# EAGLE schematic FCC Power Board Schematic (EAGLE 9.5.2)

## Sheet 1 of 2
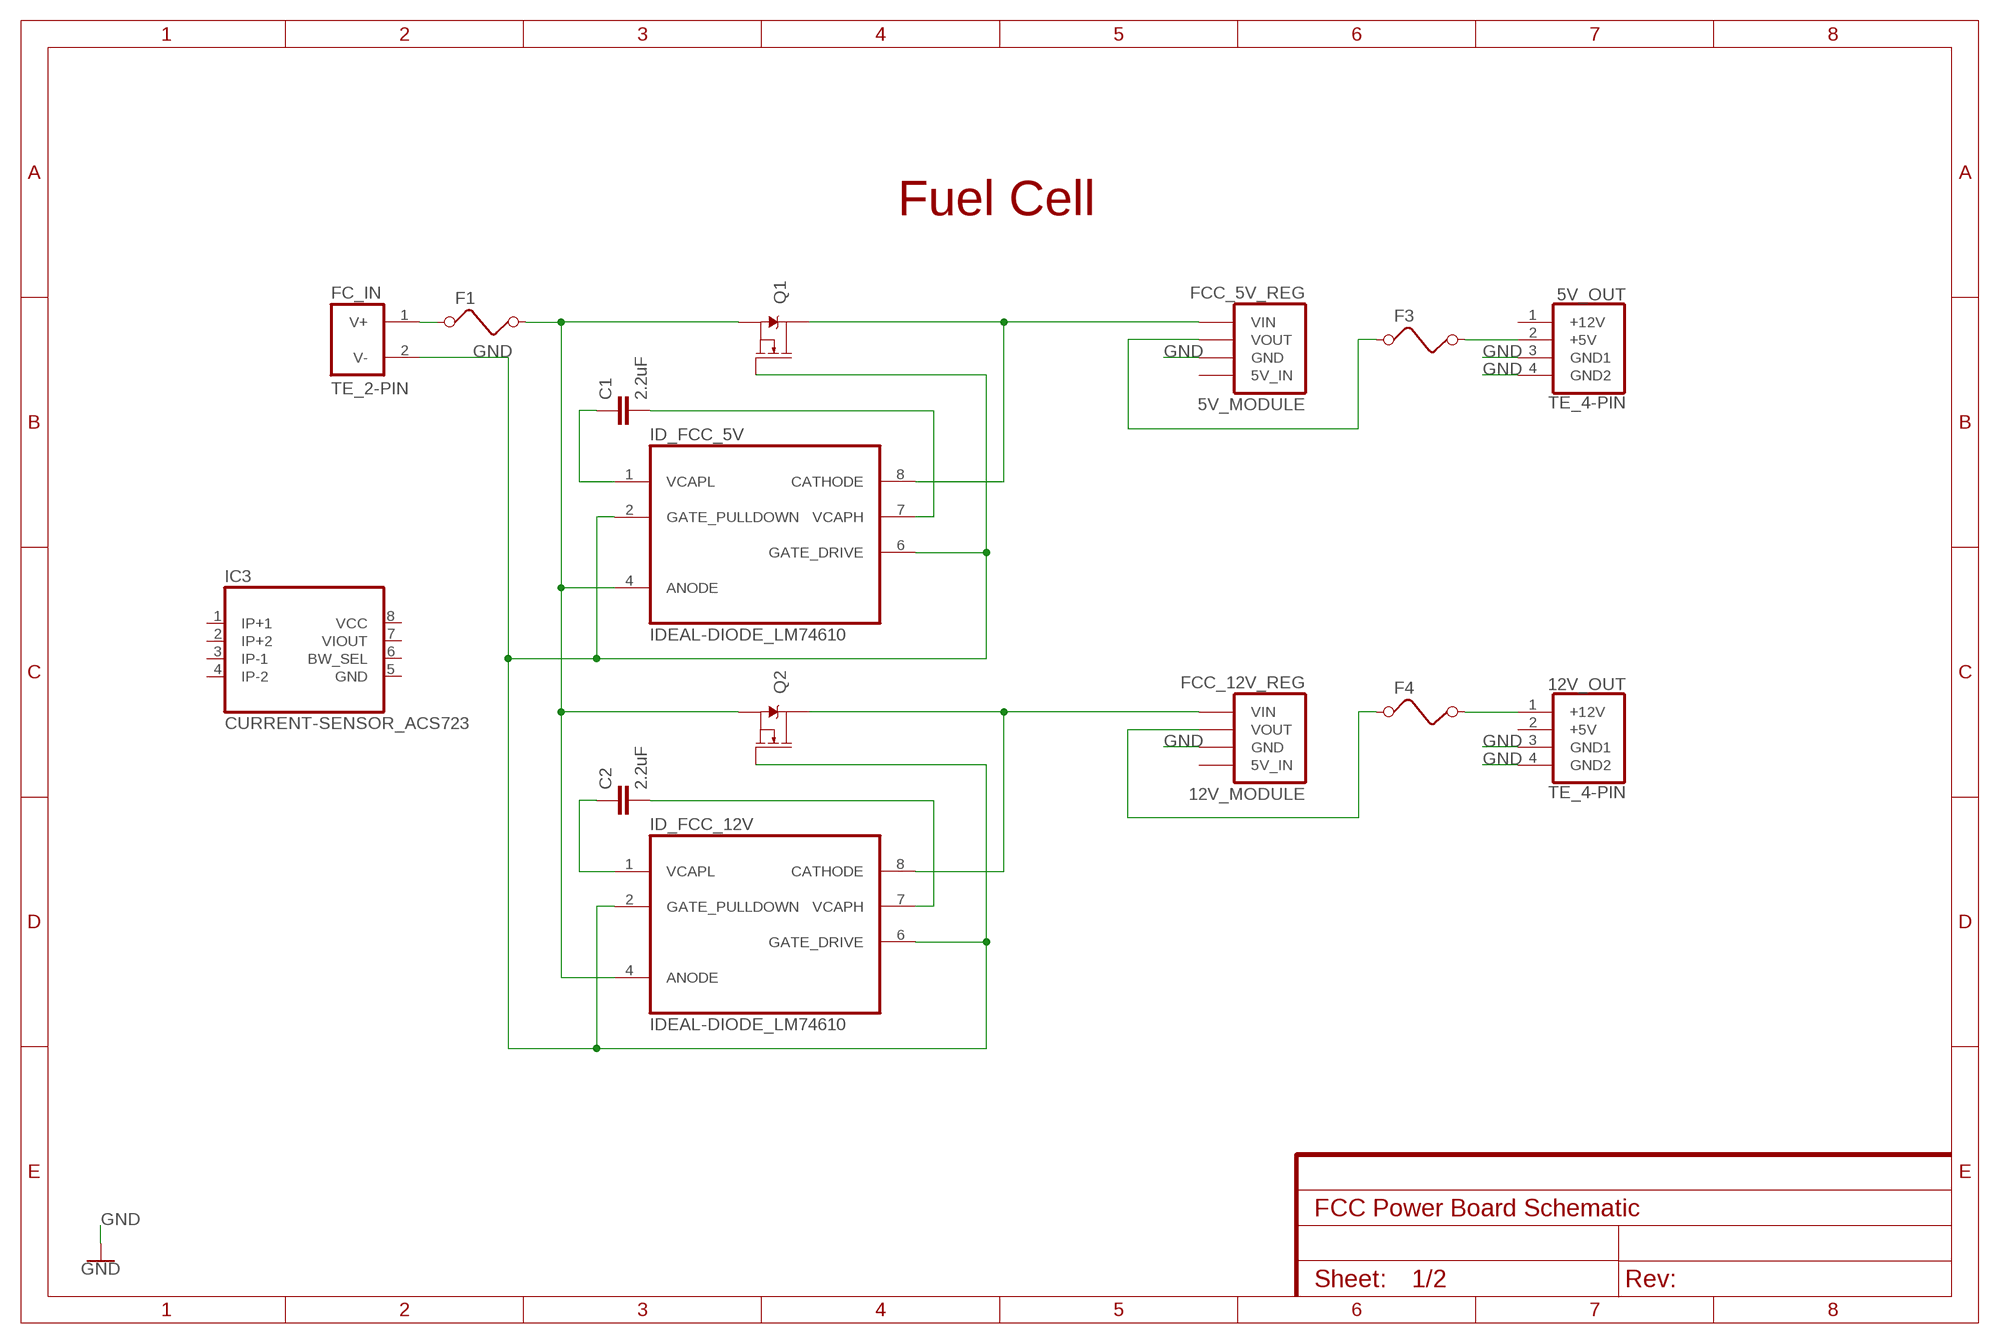
[diagram p0: schematic, sheet 1]

### Parts
5V_OUT  TE_4-PIN  [TE_4-PIN]
12V_OUT  TE_4-PIN  [TE_4-PIN]
C1  2.2uF  CAPACITOR_0805  [0805]
C2  2.2uF  CAPACITOR_0805  [0805]
F1  FUSEHOLDER_VERTICAL  [FUSEHOLDER_VERTICAL]
F3  FUSEHOLDER_VERTICAL  [FUSEHOLDER_VERTICAL]
F4  FUSEHOLDER_VERTICAL  [FUSEHOLDER_VERTICAL]
FC_IN  TE_2-PIN  [TE_2-PIN]
FCC_5V_REG  5V_MODULE  [5/12V_MODULE]
FCC_12V_REG  12V_MODULE  [5/12V_MODULE]
IC3  CURRENT-SENSOR_ACS723  [SOIC8]
ID_FCC_5V  IDEAL-DIODE_LM74610  [SOIC8]
ID_FCC_12V  IDEAL-DIODE_LM74610  [SOIC8]
Q1  MOSFET_NMOS_TO-263  [TO-263/D2PAK]
Q2  MOSFET_NMOS_TO-263  [TO-263/D2PAK]

### Nets
GND: 5V_OUT.3(GND1) 5V_OUT.4(GND2) 12V_OUT.3(GND1) 12V_OUT.4(GND2) FC_IN.2(V-) FCC_5V_REG.P$25(GND) FCC_5V_REG.P$26(GND) FCC_5V_REG.P$27(GND) FCC_5V_REG.P$28(GND) FCC_5V_REG.P$29(GND) FCC_5V_REG.P$30(GND) FCC_5V_REG.P$31(GND) FCC_12V_REG.P$25(GND) FCC_12V_REG.P$26(GND) FCC_12V_REG.P$27(GND) FCC_12V_REG.P$28(GND) FCC_12V_REG.P$29(GND) FCC_12V_REG.P$30(GND) FCC_12V_REG.P$31(GND) ID_FCC_5V.2(GATE_PULLDOWN) ID_FCC_5V.6(GATE_DRIVE) ID_FCC_12V.2(GATE_PULLDOWN) ID_FCC_12V.6(GATE_DRIVE) Q1.1(G) Q2.1(G) ; also sheet 2
N$1: F1.3 F1.4 ID_FCC_5V.4(ANODE) ID_FCC_12V.4(ANODE) Q1.3(S) Q2.3(S)
N$2: C1.1 ID_FCC_5V.1(VCAPL)
N$3: FCC_5V_REG.P$1(VIN) FCC_5V_REG.P$2(VIN) FCC_5V_REG.P$3(VIN) FCC_5V_REG.P$4(VIN) FCC_5V_REG.P$5(VIN) FCC_5V_REG.P$6(VIN) FCC_5V_REG.P$7(VIN) FCC_5V_REG.P$8(VIN) ID_FCC_5V.8(CATHODE) Q1.2(D)
N$4: F4.1 F4.2 FCC_12V_REG.P$9(VOUT) FCC_12V_REG.P$10(VOUT) FCC_12V_REG.P$11(VOUT) FCC_12V_REG.P$12(VOUT) FCC_12V_REG.P$13(VOUT) FCC_12V_REG.P$14(VOUT) FCC_12V_REG.P$15(VOUT) FCC_12V_REG.P$16(VOUT) FCC_12V_REG.P$17(VOUT) FCC_12V_REG.P$18(VOUT) FCC_12V_REG.P$19(VOUT) FCC_12V_REG.P$20(VOUT) FCC_12V_REG.P$21(VOUT) FCC_12V_REG.P$22(VOUT) FCC_12V_REG.P$23(VOUT) FCC_12V_REG.P$24(VOUT)
N$5: C1.2 ID_FCC_5V.7(VCAPH)
N$6: 12V_OUT.1(+12V) F4.3 F4.4
N$7: FCC_12V_REG.P$1(VIN) FCC_12V_REG.P$2(VIN) FCC_12V_REG.P$3(VIN) FCC_12V_REG.P$4(VIN) FCC_12V_REG.P$5(VIN) FCC_12V_REG.P$6(VIN) FCC_12V_REG.P$7(VIN) FCC_12V_REG.P$8(VIN) ID_FCC_12V.8(CATHODE) Q2.2(D)
N$9: C2.1 ID_FCC_12V.1(VCAPL)
N$10: C2.2 ID_FCC_12V.7(VCAPH)
N$11: 5V_OUT.2(+5V) F3.3 F3.4
N$15: F1.1 F1.2 FC_IN.1(V+)
N$21: F3.1 F3.2 FCC_5V_REG.P$9(VOUT) FCC_5V_REG.P$10(VOUT) FCC_5V_REG.P$11(VOUT) FCC_5V_REG.P$12(VOUT) FCC_5V_REG.P$13(VOUT) FCC_5V_REG.P$14(VOUT) FCC_5V_REG.P$15(VOUT) FCC_5V_REG.P$16(VOUT) FCC_5V_REG.P$17(VOUT) FCC_5V_REG.P$18(VOUT) FCC_5V_REG.P$19(VOUT) FCC_5V_REG.P$20(VOUT) FCC_5V_REG.P$21(VOUT) FCC_5V_REG.P$22(VOUT) FCC_5V_REG.P$23(VOUT) FCC_5V_REG.P$24(VOUT)
Unconnected: 5V_OUT.1(+12V) 12V_OUT.2(+5V) FCC_5V_REG.P$32(5V_IN) FCC_12V_REG.P$32(5V_IN) IC3.1(IP+1) IC3.2(IP+2) IC3.3(IP-1) IC3.4(IP-2) IC3.5(GND) IC3.6(BW_SEL) IC3.7(VIOUT) IC3.8(VCC)

### Notes on the sheet
- Fuel Cell

## Sheet 2 of 2
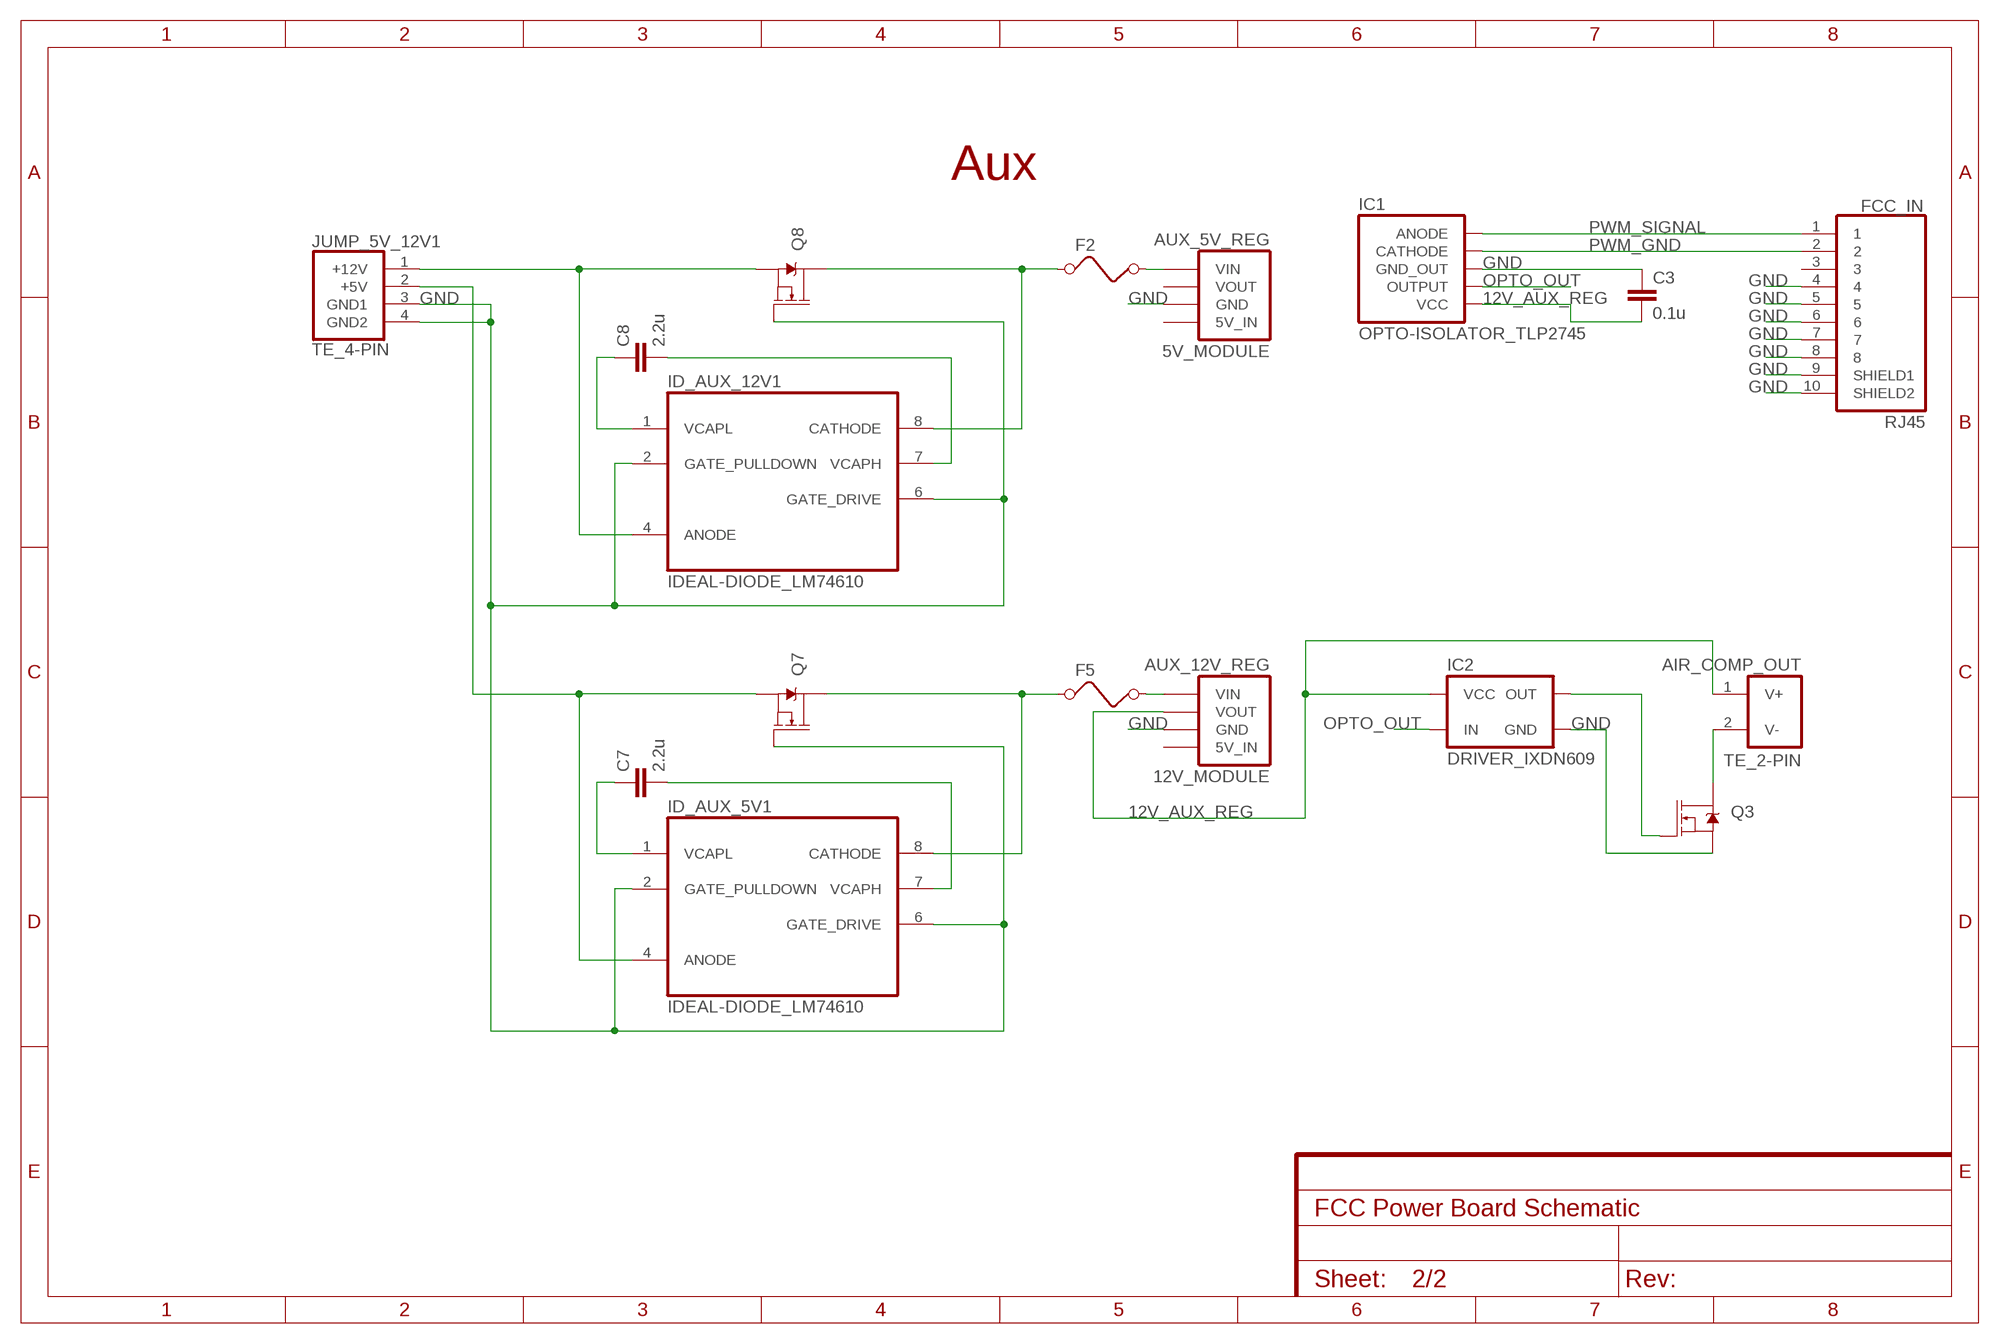
[diagram p1: schematic, sheet 2]

### Parts
AIR_COMP_OUT  TE_2-PIN  [TE_2-PIN]
AUX_5V_REG  5V_MODULE  [5/12V_MODULE]
AUX_12V_REG  12V_MODULE  [5/12V_MODULE]
C3  0.1u  CAPACITOR_0805  [0805]
C7  2.2u  CAPACITOR_0805  [0805]
C8  2.2u  CAPACITOR_0805  [0805]
F2  FUSEHOLDER_VERTICAL  [FUSEHOLDER_VERTICAL]
F5  FUSEHOLDER_VERTICAL  [FUSEHOLDER_VERTICAL]
FCC_IN  RJ45  [RJ45]
IC1  OPTO-ISOLATOR_TLP2745  [TLP2745]
IC2  DRIVER_IXDN609  [SOIC8_EXPOSED-PAD]
ID_AUX_5V1  IDEAL-DIODE_LM74610  [SOIC8]
ID_AUX_12V1  IDEAL-DIODE_LM74610  [SOIC8]
JUMP_5V_12V1  TE_4-PIN  [TE_4-PIN]
Q3  MOSFET_NMOS_TO-263  [TO-263/D2PAK]
Q7  MOSFET_NMOS_TO-263  [TO-263/D2PAK]
Q8  MOSFET_NMOS_TO-263  [TO-263/D2PAK]

### Nets
12V_AUX_REG: AIR_COMP_OUT.1(V+) AUX_12V_REG.P$9(VOUT) AUX_12V_REG.P$10(VOUT) AUX_12V_REG.P$11(VOUT) AUX_12V_REG.P$12(VOUT) AUX_12V_REG.P$13(VOUT) AUX_12V_REG.P$14(VOUT) AUX_12V_REG.P$15(VOUT) AUX_12V_REG.P$16(VOUT) AUX_12V_REG.P$17(VOUT) AUX_12V_REG.P$18(VOUT) AUX_12V_REG.P$19(VOUT) AUX_12V_REG.P$20(VOUT) AUX_12V_REG.P$21(VOUT) AUX_12V_REG.P$22(VOUT) AUX_12V_REG.P$23(VOUT) AUX_12V_REG.P$24(VOUT) C3.2 IC1.P$6(VCC) IC2.1(VCC) IC2.8(VCC)
GND: AUX_5V_REG.P$25(GND) AUX_5V_REG.P$26(GND) AUX_5V_REG.P$27(GND) AUX_5V_REG.P$28(GND) AUX_5V_REG.P$29(GND) AUX_5V_REG.P$30(GND) AUX_5V_REG.P$31(GND) AUX_12V_REG.P$25(GND) AUX_12V_REG.P$26(GND) AUX_12V_REG.P$27(GND) AUX_12V_REG.P$28(GND) AUX_12V_REG.P$29(GND) AUX_12V_REG.P$30(GND) AUX_12V_REG.P$31(GND) C3.1 FCC_IN.4 FCC_IN.5 FCC_IN.6 FCC_IN.7 FCC_IN.8 FCC_IN.9(SHIELD1) FCC_IN.10(SHIELD2) IC1.P$4(GND_OUT) IC2.4(GND) IC2.5(GND) IC2.GND ID_AUX_5V1.2(GATE_PULLDOWN) ID_AUX_5V1.6(GATE_DRIVE) ID_AUX_12V1.2(GATE_PULLDOWN) ID_AUX_12V1.6(GATE_DRIVE) JUMP_5V_12V1.3(GND1) JUMP_5V_12V1.4(GND2) Q3.3(S) Q7.1(G) Q8.1(G) ; also sheet 1
N$8: IC2.6(OUT) IC2.7(OUT) Q3.1(G)
N$12: AIR_COMP_OUT.2(V-) Q3.2(D)
N$13: AUX_12V_REG.P$1(VIN) AUX_12V_REG.P$2(VIN) AUX_12V_REG.P$3(VIN) AUX_12V_REG.P$4(VIN) AUX_12V_REG.P$5(VIN) AUX_12V_REG.P$6(VIN) AUX_12V_REG.P$7(VIN) AUX_12V_REG.P$8(VIN) F5.3 F5.4
N$14: AUX_5V_REG.P$1(VIN) AUX_5V_REG.P$2(VIN) AUX_5V_REG.P$3(VIN) AUX_5V_REG.P$4(VIN) AUX_5V_REG.P$5(VIN) AUX_5V_REG.P$6(VIN) AUX_5V_REG.P$7(VIN) AUX_5V_REG.P$8(VIN) F2.3 F2.4
N$27: ID_AUX_5V1.4(ANODE) JUMP_5V_12V1.2(+5V) Q7.3(S)
N$28: F5.1 F5.2 ID_AUX_5V1.8(CATHODE) Q7.2(D)
N$30: C7.1 ID_AUX_5V1.1(VCAPL)
N$31: C7.2 ID_AUX_5V1.7(VCAPH)
N$32: ID_AUX_12V1.4(ANODE) JUMP_5V_12V1.1(+12V) Q8.3(S)
N$33: F2.1 F2.2 ID_AUX_12V1.8(CATHODE) Q8.2(D)
N$35: C8.1 ID_AUX_12V1.1(VCAPL)
N$36: C8.2 ID_AUX_12V1.7(VCAPH)
OPTO_OUT: IC1.P$5(OUTPUT) IC2.2(IN)
PWM_GND: FCC_IN.2 IC1.P$3(CATHODE)
PWM_SIGNAL: FCC_IN.1 IC1.P$1(ANODE)
Unconnected: AUX_5V_REG.P$9(VOUT) AUX_5V_REG.P$10(VOUT) AUX_5V_REG.P$11(VOUT) AUX_5V_REG.P$12(VOUT) AUX_5V_REG.P$13(VOUT) AUX_5V_REG.P$14(VOUT) AUX_5V_REG.P$15(VOUT) AUX_5V_REG.P$16(VOUT) AUX_5V_REG.P$17(VOUT) AUX_5V_REG.P$18(VOUT) AUX_5V_REG.P$19(VOUT) AUX_5V_REG.P$20(VOUT) AUX_5V_REG.P$21(VOUT) AUX_5V_REG.P$22(VOUT) AUX_5V_REG.P$23(VOUT) AUX_5V_REG.P$24(VOUT) AUX_5V_REG.P$32(5V_IN) AUX_12V_REG.P$32(5V_IN) FCC_IN.3

### Notes on the sheet
- Aux

## Library data of the parts
5V_OUT 12V_OUT JUMP_5V_12V1 = EcoCar-Connectors:TE_4-PIN: 4 Pin TE Mini-Universal MATE-N-LOK - Use for 12V and 5V connections Part Number: 1-770968-0 Digikey Part Number: A32474-ND Matching Plug: A25571-ND Matching Crimps: A100828CT-ND
AIR_COMP_OUT FC_IN = EcoCar-Connectors:TE_2-PIN: 2 Pin TE Mini-Universal MATE-N-LOK - Use for signals and power connections Part Number: 1-770966-0 Digikey Part Number: A32471-ND Matching Plug: A25587-ND Matching Crimps: A100828CT-ND
AUX_5V_REG FCC_5V_REG = EcoCar-Modules:5V_MODULE: 5V Regulator Module Notes: 1) if duty cycle > 65%, connect external 5V source to improve efficiency 2) the 12V and 5V regulator modules use the same PCB. Make sure to solder the proper header for 12V or 5V. Use the correct resistor ratio for 12V or 5V.
AUX_12V_REG FCC_12V_REG = EcoCar-Modules:12V_MODULE: 12V Regulator Module Notes: 1) if duty cycle > 65%, connect external 5V source to improve efficiency 2) the 12V and 5V regulator modules use the same PCB. Make sure to solder the proper header for 12V or 5V. Use the correct resistor ratio for 12V or 5V.
C1-C3 C7 C8 = EcoCar-Passives:CAPACITOR_0805
F1-F5 = EcoCar-Fuses-Protection:FUSEHOLDER_VERTICAL: Vertical Fuse Holder for Mini Blade Fuses Manufacturer: Keystone Part Number: 3568 Digikey Part Number: 36-3568-ND
FCC_IN = EcoCar-Connectors:RJ45: RJ45 Connector - Use for signals and low power connections Unshielded Part Number: RJHSE-5080 Unshielded Digikey Part Number: RJHSE-5080-ND Shielded Part Number: RJHSE5E80 Shielded Digikey Part Number: RJHSE5E80-ND
IC1 = EcoCar-Integrated-Circuits:OPTO-ISOLATOR_TLP2745: Opto-Isolator with Push-Pull Output Manufacturer: Toshiba Part Number: TLP2745(TP,E Digikey Part Number: TLP2745(TPECT-ND
IC2 = EcoCar-Integrated-Circuits:DRIVER_IXDN609: IXDN609 Non-Inverting Mosfet Driver (9A Max) Manufacturer: IXYS Part Number: IXDN609SI Digikey Part Number: CLA364-ND
IC3 = EcoCar-Integrated-Circuits:CURRENT-SENSOR_ACS723: 10A Hall Effect Current Sensor Manufacturer: Allegro MicroSystems Part Number: ACS723LLCTR-10AU-T Digikey Part Number: 620-1643-1-ND Note: pinout fixed Nov 28, 2019
ID_AUX_5V1 ID_AUX_12V1 ID_FCC_5V ID_FCC_12V = EcoCar-Integrated-Circuits:IDEAL-DIODE_LM74610: Ideal Diode Controller Manufacturer: Texas Instruments Part Number: LM74610QDGKRQ1 Digikey Part Number: 296-43067-1-ND
Q1-Q3 Q7 Q8 = EcoCar-Discrete-Semiconductors:MOSFET_NMOS_TO-263